# EAGLE design EYEO_Flower3_Sch (EAGLE 9.6.2)
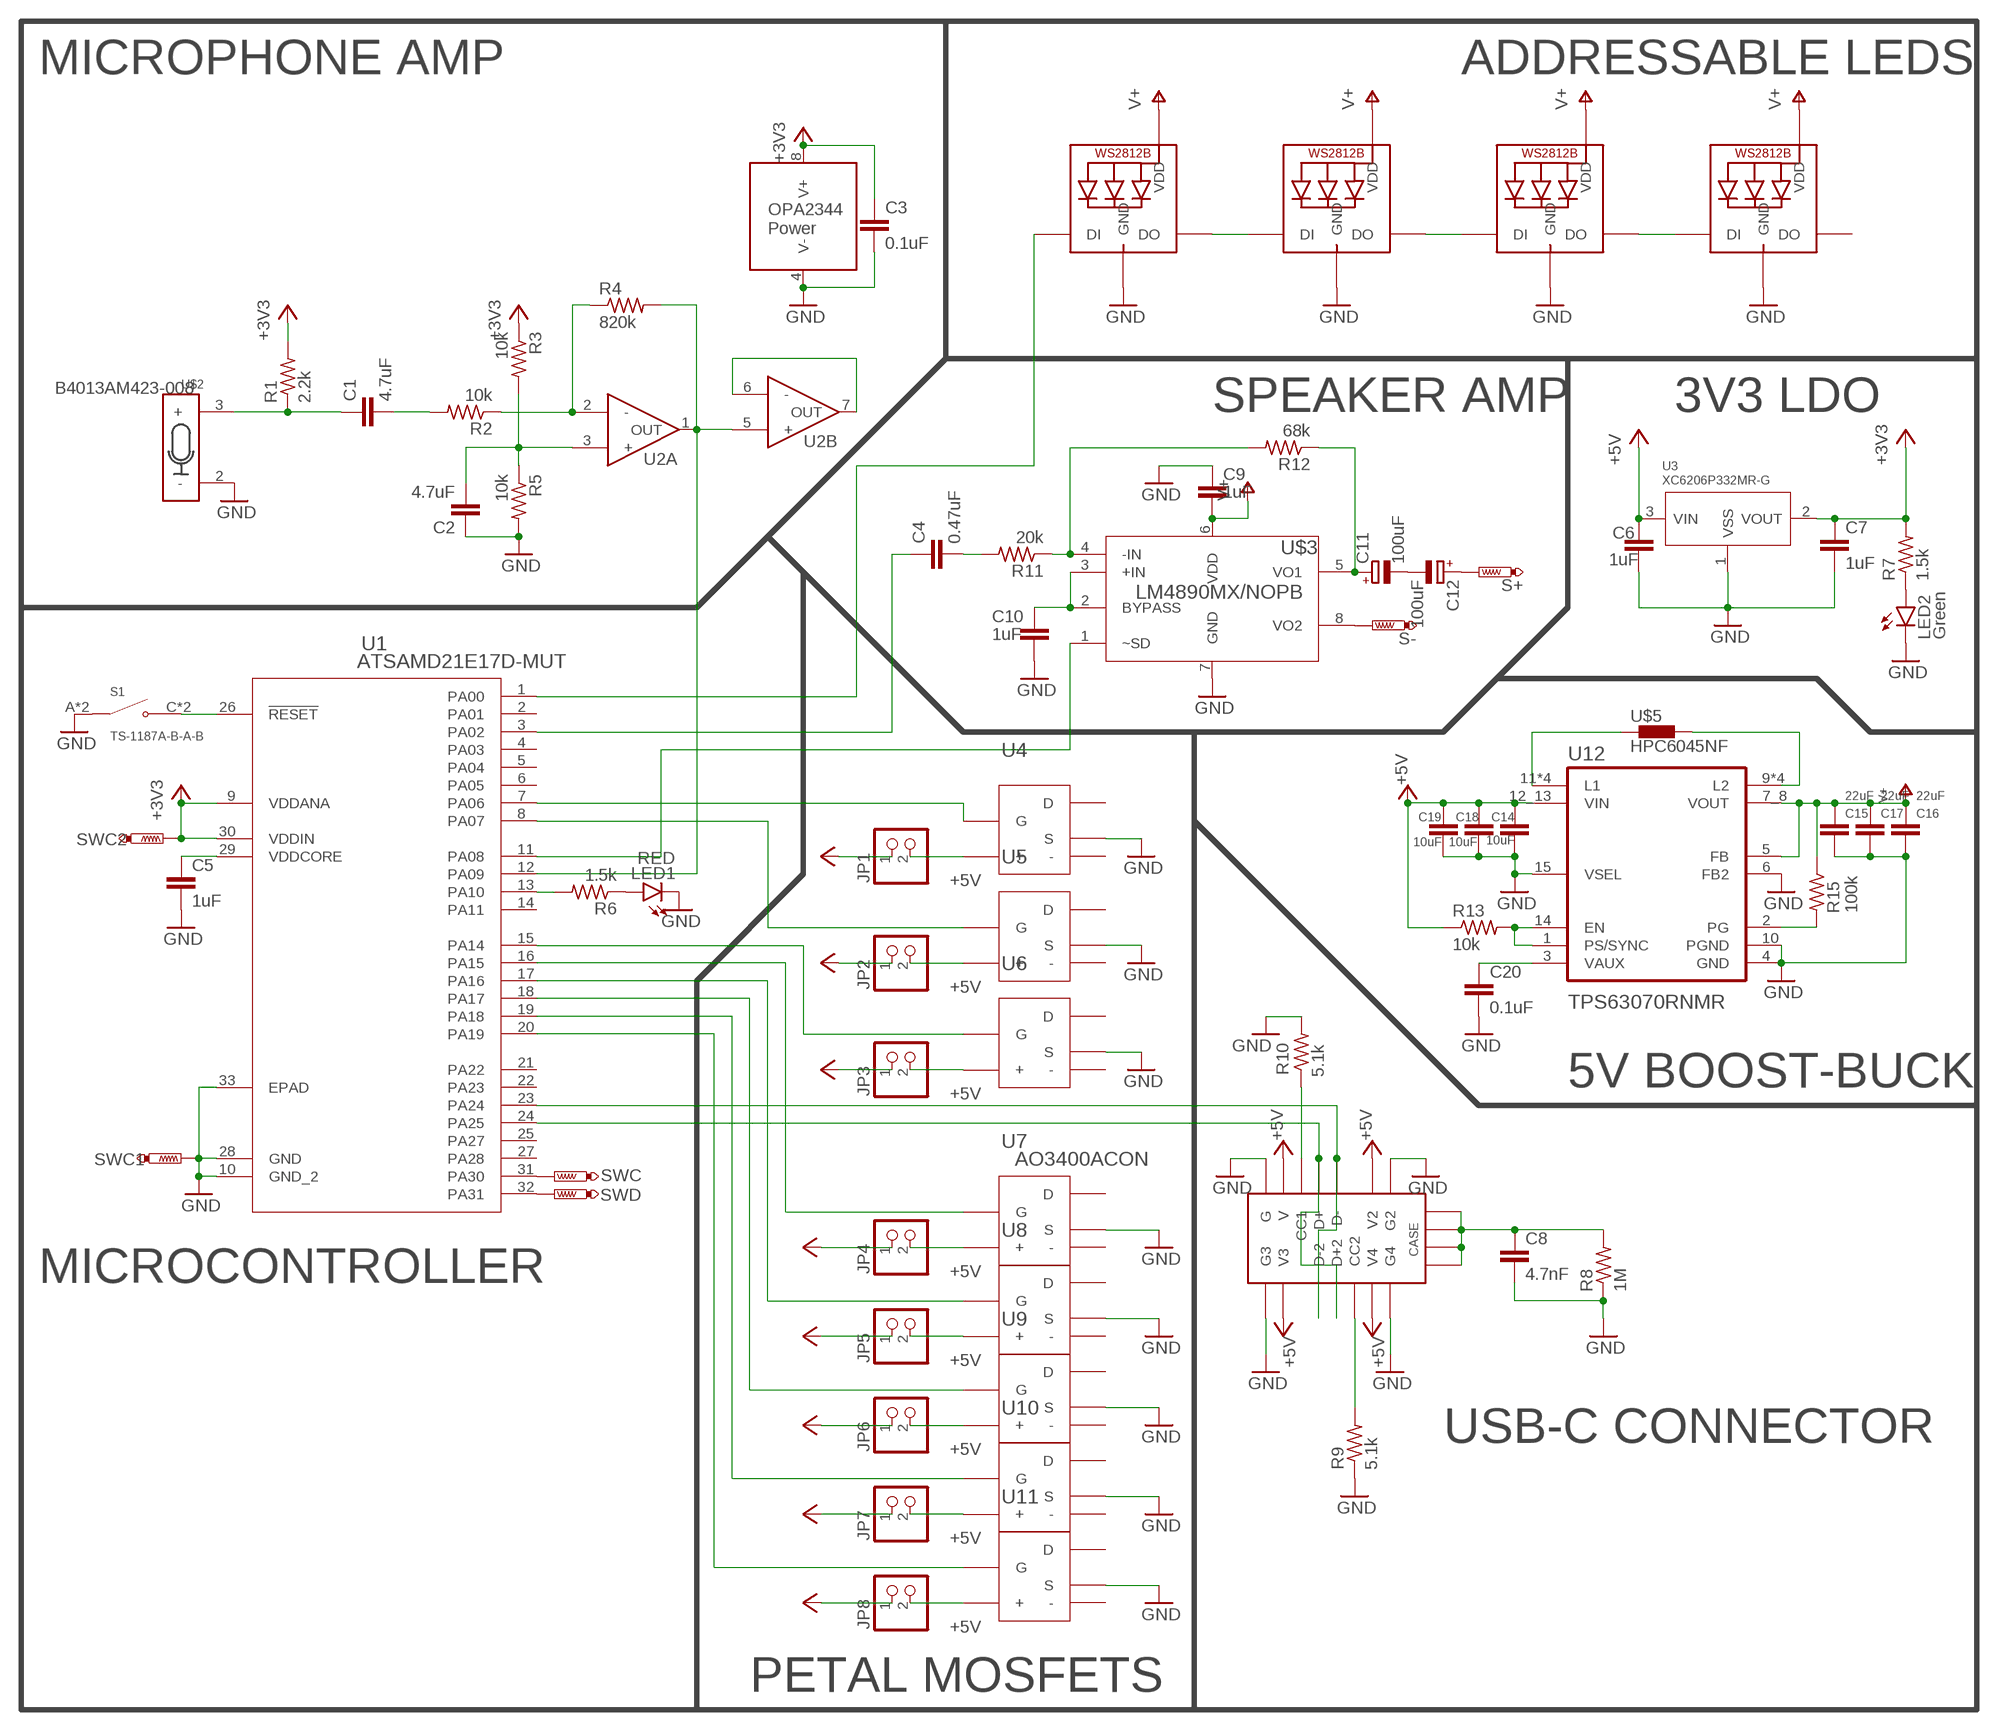
[diagram p0: schematic, sheet 1]

## Parts
C1  4.7uF  C-EUC0603  [C0603]
C2  4.7uF  C-EUC0603  [C0603]
C3  0.1uF  C-EUC0402  [C0402]
C4  0.47uF  C-EUC0603  [C0603]
C5  1uF  C-EUC0603  [C0603]
C6  1uF  C-EUC0603  [C0603]
C7  1uF  C-EUC0603  [C0603]
C8  4.7nF  C-EUC0402  [C0402]
C9  1uF  C-EUC0603  [C0603]
C10  1uF  C-EUC0603  [C0603]
C11  100uF  CPOL-EU153CLV-0505  [153CLV-0505]
C12  100uF  CPOL-EU153CLV-0505  [153CLV-0505]
C14  10uF  C-EUC0603  [C0603]
C15  22uF  C-EUC0603  [C0603]
C16  22uF  C-EUC0603  [C0603]
C17  22uF  C-EUC0603  [C0603]
C18  10uF  C-EUC0603  [C0603]
C19  10uF  C-EUC0603  [C0603]
C20  0.1uF  C-EUC0402  [C0402]
JP1  PINHD-1X2  [1X02]
JP2  PINHD-1X2  [1X02]
JP3  PINHD-1X2  [1X02]
JP4  PINHD-1X2  [1X02]
JP5  PINHD-1X2  [1X02]
JP6  PINHD-1X2  [1X02]
JP7  PINHD-1X2  [1X02]
JP8  PINHD-1X2  [1X02]
LED1  RED  LEDCHIPLED_0805  [CHIPLED_0805]
LED2  Green  LEDCHIPLED_0603  [CHIPLED_0603]
LED3  WS2812B5050  [WS2812B]
LED4  WS2812B5050  [WS2812B]
LED5  WS2812B5050  [WS2812B]
LED6  WS2812B5050  [WS2812B]
R1  2.2k  R-US_R0402  [R0402]
R2  10k  R-US_R0402  [R0402]
R3  10k  R-US_R0402  [R0402]
R4  820k  R-US_R0402  [R0402]
R5  10k  R-US_R0402  [R0402]
R6  1.5k  R-US_R0402  [R0402]
R7  1.5k  R-US_R0402  [R0402]
R8  1M  R-US_R0402  [R0402]
R9  5.1k  R-US_R0402  [R0402]
R10  5.1k  R-US_R0402  [R0402]
R11  20k  R-US_R0402  [R0402]
R12  68k  R-US_R0402  [R0402]
R13  10k  R-US_R0402  [R0402]
R15  100k  R-US_R0402  [R0402]
S1  TS-1187A-B-A-B  [SW_TS-1187A-B-A-B]
S+  PTR11MM  [1MM]
S-  PTR11MM  [1MM]
SWC  PTR1PAD1-13  [P1-13]
SWC1  PTR1PAD1-13  [P1-13]
SWC2  PTR1PAD1-13  [P1-13]
SWD  PTR1PAD1-13  [P1-13]
U1  ATSAMD21E17D-MUT  [QFN32_5X5MC_MCH]
U2  OPA2344UA  [D8]
U3  XC6206P332MR-G  PMIC-LDO-XC6206P332MR-G(SOT23)  [SOT-23]
U4  AO3400ACON  [SOT23-BCE-CON]
U5  AO3400ACON  [SOT23-BCE-CON]
U6  AO3400ACON  [SOT23-BCE-CON]
U7  AO3400ACON  [SOT23-BCE-CON]
U8  AO3400ACON  [SOT23-BCE-CON]
U9  AO3400ACON  [SOT23-BCE-CON]
U10  AO3400ACON  [SOT23-BCE-CON]
U11  AO3400ACON  [SOT23-BCE-CON]
U12  TPS63070RNMR  [VREG_TPS63070RNMR]
U$1  USB-C  [918-418K2022Y40000]
U$2  B4013AM423  [B4013AM423]
U$3  LM4890MX/NOPB  [M08A]
U$5  HPC6045NF  [HPC6045NF]

## Nets
+3V3: C3.1 C7.1 R1.2 R3.1 R7.2 SWC2.TP U1.9(VDDANA) U1.30(VDDIN) U2.8(C:V+) U3.2(VOUT)
+5V: C6.1 C14.1 C18.1 C19.1 JP1.1 JP2.1 JP3.1 JP4.1 JP5.1 JP6.1 JP7.1 JP8.1 R13.1 U3.3(VIN) U12.12_13(VIN) U$1.V U$1.V2 U$1.V3 U$1.V4
GND: C2.1 C3.2 C5.2 C6.2 C7.2 C8.2 C9.1 C10.2 C14.2 C15.2 C16.2 C17.2 C18.2 C19.2 C20.2 LED1.C LED2.C LED3.3-GND(GND) LED4.3-GND(GND) LED5.3-GND(GND) LED6.3-GND(GND) R5.2 R8.1 R9.1 R10.2 S1.A(COM) S1.B(COM) SWC1.TP U1.10(GND_2) U1.28(GND) U1.33(EPAD) U2.4(C:V-) U3.1(VSS) U4.S U5.S U6.S U7.S U8.S U9.S U10.S U11.S U12.4(GND) U12.6(FB2) U12.10(PGND) U12.15(VSEL) U$1.G U$1.G2 U$1.G3 U$1.G4 U$2.2(-) U$3.7(GND)
N$1: LED1.A R6.1
N$2: S1.C(NO) S1.D(NO) U1.26(!RESET)
N$3: LED2.A R7.1
N$4: C5.1 U1.29(VDDCORE)
N$5: C8.1 R8.2 U$1.OG1 U$1.OG2 U$1.OG3 U$1.OG4
N$6: R6.2 U1.13(PA10)
N$7: U1.23(PA24) U$1.D- U$1.D-2
N$8: U1.24(PA25) U$1.D+ U$1.D+2
N$9: SWC.TP U1.31(PA30)
N$10: SWD.TP U1.32(PA31)
N$11: R4.2 U1.12(PA09) U2.1(A:OUT) U2.5(B:+)
N$12: R2.1 R4.1 U2.2(A:-)
N$13: R10.1 U$1.CC1
N$14: R9.2 U$1.CC2
N$15: C2.2 R3.2 R5.1 U2.3(A:+)
N$16: C1.2 R2.2
N$17: C1.1 R1.1 U$2.3(+)
N$18: U2.6(B:-) U2.7(B:OUT)
N$19: C4.1 U1.3(PA02)
N$20: C4.2 R11.2
N$21: R11.1 R12.2 U$3.4(-IN)
N$22: C11.- C12.-
N$23: C10.1 U$3.2(BYPASS) U$3.3(+IN)
N$24: C11.+ R12.1 U$3.5(VO1)
N$25: U1.11(PA08) U$3.1(~SD)
N$26: S-.TP U$3.8(VO2)
N$27: U1.7(PA06) U4.G
N$28: U1.8(PA07) U5.G
N$29: U1.15(PA14) U6.G
N$30: U1.16(PA15) U7.G
N$31: U1.17(PA16) U8.G
N$32: U1.18(PA17) U9.G
N$33: U1.19(PA18) U10.G
N$34: U1.20(PA19) U11.G
N$35: LED3.4-DIN(DI) U1.1(PA00)
N$36: LED3.2-DOUT(DO) LED4.4-DIN(DI)
N$37: LED4.2-DOUT(DO) LED5.4-DIN(DI)
N$38: LED5.2-DOUT(DO) LED6.4-DIN(DI)
N$39: C12.+ S+.TP
N$40: JP1.2 U4.+
N$41: JP2.2 U5.+
N$42: JP3.2 U6.+
N$43: JP4.2 U7.+
N$44: JP5.2 U8.+
N$45: JP6.2 U9.+
N$46: JP7.2 U10.+
N$47: JP8.2 U11.+
N$49: R13.2 U12.1(PS/SYNC) U12.14(EN)
N$50: U12.11(L1) U12.11_1(L1) U12.11_2(L1) U12.11_3(L1) U$5.P$1
N$51: C20.1 U12.3(VAUX)
N$52: U12.9(L2) U12.9_1(L2) U12.9_2(L2) U12.9_3(L2) U$5.P$2
N$54: R15.2 U12.2(PG)
V+: C9.2 C15.1 C16.1 C17.1 LED3.1-VDD(VDD) LED4.1-VDD(VDD) LED5.1-VDD(VDD) LED6.1-VDD(VDD) R15.1 U12.5(FB) U12.7_8(VOUT) U$3.6(VDD)
Unconnected: LED6.2-DOUT(DO) U1.2(PA01) U1.4(PA03) U1.5(PA04) U1.6(PA05) U1.14(PA11) U1.21(PA22) U1.22(PA23) U1.25(PA27) U1.27(PA28) U4.- U4.D U5.- U5.D U6.- U6.D U7.- U7.D U8.- U8.D U9.- U9.D U10.- U10.D U11.- U11.D

## Notes on the sheet
- MICROPHONE AMP | ADDRESSABLE LEDS
- SPEAKER AMP | 3V3 LDO
- 5V BOOST-BUCK
- MICROCONTROLLER
- USB-C CONNECTOR
- PETAL MOSFETS

## Library data of the parts
C1 C2 = rcl_MOD:C-EU: CAPACITOR, European symbol; LCSC_PART: C19666; SPICEPREFIX: C
C3 C20 = rcl_MOD:C-EU: CAPACITOR, European symbol; LCSC_PART: C307331; SPICEPREFIX: C
C4 = rcl_MOD:C-EU: CAPACITOR, European symbol; LCSC_PART: C1623; SPICEPREFIX: C
C5-C7 C9 C10 = rcl_MOD:C-EU: CAPACITOR, European symbol; LCSC_PART: C15849; SPICEPREFIX: C
C8 = rcl_MOD:C-EU: CAPACITOR, European symbol; LCSC_PART: C1538; SPICEPREFIX: C
C11 C12 = rcl_MOD:CPOL-EU: POLARIZED CAPACITOR, European symbol; LCSC_PART: C3347; SPICEPREFIX: C
C14 C18 C19 = rcl_MOD:C-EU: CAPACITOR, European symbol; LCSC_PART: C96446; SPICEPREFIX: C
C15-C17 = rcl_MOD:C-EU: CAPACITOR, European symbol; LCSC_PART: C59461; SPICEPREFIX: C
JP1-JP8 = pinhead:PINHD-1X2: PIN HEADER; LCSC_PART: C2889984
LED1 = led:LED: LED OSRAM: - CHIPLED LG R971, LG N971, LY N971, LG Q971, LY Q971, LO R971, LY R971 LH N974, LH R974 LS Q976, LO Q976, LY Q976 LO Q996 - Hyper CHIPLED LW Q18S LB Q993, LB Q99A, LB R99A - SideLED LS A670, LO A670, LY A670, LG A670, LP A670 LB A673, LV A673, LT A673, LW A673 LH A674 LY A675 LS A676, LA A676, LO A676, LY A676, LW A676 LS A679, LY A679, LG A679 - Hyper Micro SIDELED® LS Y876, LA Y876, LO Y876, LY Y876 LT Y87S - SmartLED LW L88C, LW L88S LB L89C, LB L89S, LG L890 LS L89K, LO L89K, LY L89K LS L896, LA L896, LO L896, LY L896 - TOPLED LS T670, LO T670, LY T670, LG T670, LP T670 LSG T670, LSP T670, LSY T670, LOP T670, LYG T670 LG T671, LOG T671, LSG T671 LB T673, LV T673, LT T673, LW T673 LH T674 LS T676, LA T676, LO T676, LY T676, LB T676, LH T676, LSB T676, LW T676 LB T67C, LV T67C, LT T67C, LS T67K, LO T67K, LY T67K, LW E67C LS E67B, LA E67B, LO E67B, LY E67B, LB E67C, LV E67C, LT E67C LW T67C LS T679, LY T679, LG T679 LS T770, LO T770, LY T770, LG T770, LP T770 LB T773, LV T773, LT T773, LW T773 LH T774 LS E675, LA E675, LY E675, LS T675 LS T776, LA T776, LO T776, LY T776, LB T776 LHGB T686 LT T68C, LB T68C - Hyper Mini TOPLED® LB M676 - Mini TOPLED Santana® LG M470 LS M47K, LO M47K, LY M47K Source: http://www.osram.convergy.de LUXEON: - LUMILED® LXK2-PW12-R00, LXK2-PW12-S00, LXK2-PW14-U00, LXK2-PW14-V00 LXK2-PM12-R00, LXK2-PM12-S00, LXK2-PM14-U00 LXK2-PE12-Q00, LXK2-PE12-R00, LXK2-PE12-S00, LXK2-PE14-T00, LXK2-PE14-U00 LXK2-PB12-K00, LXK2-PB12-L00, LXK2-PB12-M00, LXK2-PB14-N00, LXK2-PB14-P00, LXK2-PB14-Q00 LXK2-PR12-L00, LXK2-PR12-M00, LXK2-PR14-Q00, LXK2-PR14-R00 LXK2-PD12-Q00, LXK2-PD12-R00, LXK2-PD12-S00 LXK2-PH12-R00, LXK2-PH12-S00 LXK2-PL12-P00, LXK2-PL12-Q00, LXK2-PL12-R00 Source: www.luxeon.com KINGBRIGHT: KA-3528ASYC Source: www.kingbright.com; LCSC_PART: C84256
LED2 = led:LED: LED OSRAM: - CHIPLED LG R971, LG N971, LY N971, LG Q971, LY Q971, LO R971, LY R971 LH N974, LH R974 LS Q976, LO Q976, LY Q976 LO Q996 - Hyper CHIPLED LW Q18S LB Q993, LB Q99A, LB R99A - SideLED LS A670, LO A670, LY A670, LG A670, LP A670 LB A673, LV A673, LT A673, LW A673 LH A674 LY A675 LS A676, LA A676, LO A676, LY A676, LW A676 LS A679, LY A679, LG A679 - Hyper Micro SIDELED® LS Y876, LA Y876, LO Y876, LY Y876 LT Y87S - SmartLED LW L88C, LW L88S LB L89C, LB L89S, LG L890 LS L89K, LO L89K, LY L89K LS L896, LA L896, LO L896, LY L896 - TOPLED LS T670, LO T670, LY T670, LG T670, LP T670 LSG T670, LSP T670, LSY T670, LOP T670, LYG T670 LG T671, LOG T671, LSG T671 LB T673, LV T673, LT T673, LW T673 LH T674 LS T676, LA T676, LO T676, LY T676, LB T676, LH T676, LSB T676, LW T676 LB T67C, LV T67C, LT T67C, LS T67K, LO T67K, LY T67K, LW E67C LS E67B, LA E67B, LO E67B, LY E67B, LB E67C, LV E67C, LT E67C LW T67C LS T679, LY T679, LG T679 LS T770, LO T770, LY T770, LG T770, LP T770 LB T773, LV T773, LT T773, LW T773 LH T774 LS E675, LA E675, LY E675, LS T675 LS T776, LA T776, LO T776, LY T776, LB T776 LHGB T686 LT T68C, LB T68C - Hyper Mini TOPLED® LB M676 - Mini TOPLED Santana® LG M470 LS M47K, LO M47K, LY M47K Source: http://www.osram.convergy.de LUXEON: - LUMILED® LXK2-PW12-R00, LXK2-PW12-S00, LXK2-PW14-U00, LXK2-PW14-V00 LXK2-PM12-R00, LXK2-PM12-S00, LXK2-PM14-U00 LXK2-PE12-Q00, LXK2-PE12-R00, LXK2-PE12-S00, LXK2-PE14-T00, LXK2-PE14-U00 LXK2-PB12-K00, LXK2-PB12-L00, LXK2-PB12-M00, LXK2-PB14-N00, LXK2-PB14-P00, LXK2-PB14-Q00 LXK2-PR12-L00, LXK2-PR12-M00, LXK2-PR14-Q00, LXK2-PR14-R00 LXK2-PD12-Q00, LXK2-PD12-R00, LXK2-PD12-S00 LXK2-PH12-R00, LXK2-PH12-S00 LXK2-PL12-P00, LXK2-PL12-Q00, LXK2-PL12-R00 Source: www.luxeon.com KINGBRIGHT: KA-3528ASYC Source: www.kingbright.com; LCSC_PART: C72043
LED3-LED6 = WS2812B:WS2812B: Check availability <https://pricing.snapeda.com/parts/WS2812B/Worldsemi/view-part?ref=eda>; AVAILABILITY: Not in stock; DESCRIPTION: Intelligent Control Led Integrated Light Source Pack Of 10; LCSC_PART: C2761795; MF: Worldsemi; MP: WS2812B; PACKAGE: None; PRICE: None
R1 = rcl_MOD:R-US_: RESISTOR, American symbol; LCSC_PART: C25879; SPICEPREFIX: R
R2 R3 R5 R13 = rcl_MOD:R-US_: RESISTOR, American symbol; LCSC_PART: C25744; SPICEPREFIX: R
R4 = rcl_MOD:R-US_: RESISTOR, American symbol; LCSC_PART: C67558; SPICEPREFIX: R
R6 R7 = rcl_MOD:R-US_: RESISTOR, American symbol; LCSC_PART: C25867; SPICEPREFIX: R
R8 = rcl_MOD:R-US_: RESISTOR, American symbol; LCSC_PART: C26083; SPICEPREFIX: R
R9 R10 = rcl_MOD:R-US_: RESISTOR, American symbol; LCSC_PART: C25905; SPICEPREFIX: R
R11 = rcl_MOD:R-US_: RESISTOR, American symbol; LCSC_PART: C25765; SPICEPREFIX: R
R12 = rcl_MOD:R-US_: RESISTOR, American symbol; LCSC_PART: C36871; SPICEPREFIX: R
R15 = rcl_MOD:R-US_: RESISTOR, American symbol; LCSC_PART: C25741; SPICEPREFIX: R
S1 = TS-1187A-B-A-B:TS-1187A-B-A-B: SPST 50mA @ 12VDC Top Actuated Round Button 160gf SMD Tactile Switches RoHS Check availability <https://pricing.snapeda.com/parts/TS-1187A-B-A-B/XKB%20Industrial%20Precision/view-part?ref=eda>; AVAILABILITY: Not in stock; DESCRIPTION: TS-1187A-B-A-B XKB Connectivity; LCSC_PART: C318884; MF: XKB Industrial Precision; MP: TS-1187A-B-A-B; PACKAGE: Package; PRICE: None
S+ S- = testpad:PTR1: TEST PIN; LCSC_PART: C238122
SWC SWC1 SWC2 SWD = testpad:PTR1: TEST PIN
U1 = ATSAMDE17D:ATSAMD21E17D-MUT; COPYRIGHT: Copyright (C) 2022 Ultra Librarian. All rights reserved.; DIGI-KEY_PART_NUMBER_1: ATSAMD21E17D-MUTCT-ND; DIGI-KEY_PART_NUMBER_2: ATSAMD21E17D-MUTDKR-ND; DIGI-KEY_PART_NUMBER_3: ATSAMD21E17D-MUTTR-ND; MANUFACTURER_PART_NUMBER: ATSAMD21E17D-MUT; MFR_NAME: Microchip
U2 = OPA2344:OPA2344UA; COPYRIGHT: Copyright (C) 2022 Ultra Librarian. All rights reserved.; DIGI-KEY_PART_NUMBER_1: OPA2344UA-ND; DIGI-KEY_PART_NUMBER_2: 2156-OPA2344UA-ND; DIGI-KEY_PART_NUMBER_3: 2156-OPA2344UA-TI-ND; LCSC_PART: C202213; MANUFACTURER_PART_NUMBER: OPA2344UA; MFR_NAME: Texas Instruments
U3 = PMIC-LDO-XC6206P332MR-G_SOT23_:PMIC-LDO-XC6206P332MR-G(SOT23): 310030099 Check availability <https://pricing.snapeda.com/parts/XC6206P332MR-G/Torex/view-part?ref=eda>; AVAILABILITY: In Stock; DESCRIPTION: Linear Voltage Regulator IC Positive Fixed 1 Output 200mA SOT-23; LCSC_PART: C5446; MF: Torex; MP: XC6206P332MR-G; PACKAGE: SOT-23-3 Torex; PRICE: None; PURCHASE-URL: https://pricing.snapeda.com/search/part/XC6206P332MR-G/?ref=eda
U4-U11 = AO3400A+con:AO3400A; LCSC_PART: C20917
U12 = TPS63070RNMR:TPS63070RNMR: Check availability <https://pricing.snapeda.com/parts/TPS63070RNMR/Texas%20Instruments/view-part?ref=eda>; AVAILABILITY: In Stock; DESCRIPTION: Wide input voltage (2V-16V) buck-boost converter; LCSC_PART: C2876599; MF: Texas Instruments; MP: TPS63070RNMR; PACKAGE: VQFN-HR-15 Texas Instruments; PRICE: None; PURCHASE-URL: https://pricing.snapeda.com/search/part/TPS63070RNMR/?ref=eda
U$1 = USB:USB-C; LCSC_PART: C168704
U$2 = Microphone:B4013AM423; LCSC_PART: C233794; NUM: B4013AM423-008
U$3 = LM4890:LM4890MX/NOPB; COPYRIGHT: Copyright (C) 2022 Ultra Librarian. All rights reserved.; DIGI-KEY_PART_NUMBER_1: 2156-LM4890MX/NOPB-ND; DIGI-KEY_PART_NUMBER_2: 296-47333-1-ND; DIGI-KEY_PART_NUMBER_3: 296-47333-2-ND; DIGI-KEY_PART_NUMBER_4: 296-47333-6-ND; DIGI-KEY_PART_NUMBER_5: LM4890MX/NOPBTR-ND; LCSC_PART: C117476; MANUFACTURER_PART_NUMBER: LM4890MX/NOPB; MFR_NAME: Texas Instruments
U$5 = inductors-mod:HPC6045NF; LCSC_PART: C357076

## Board
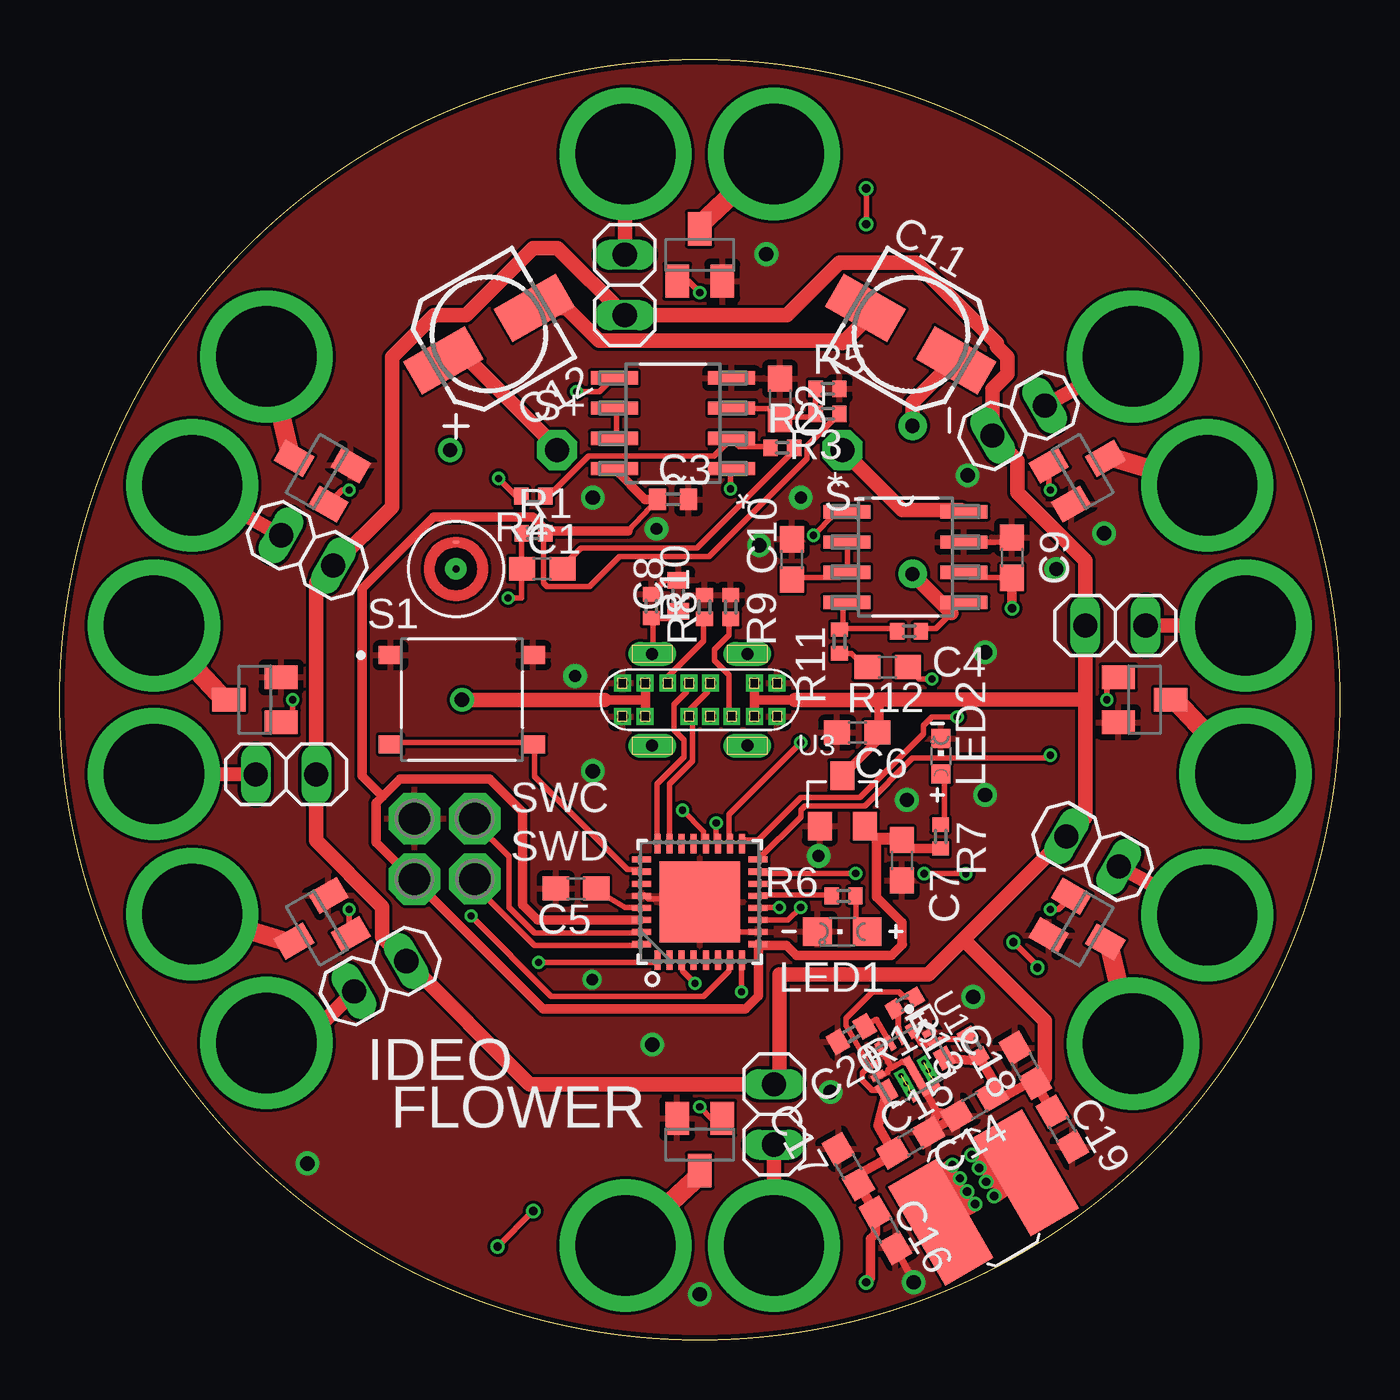
[diagram p1: board, top side]
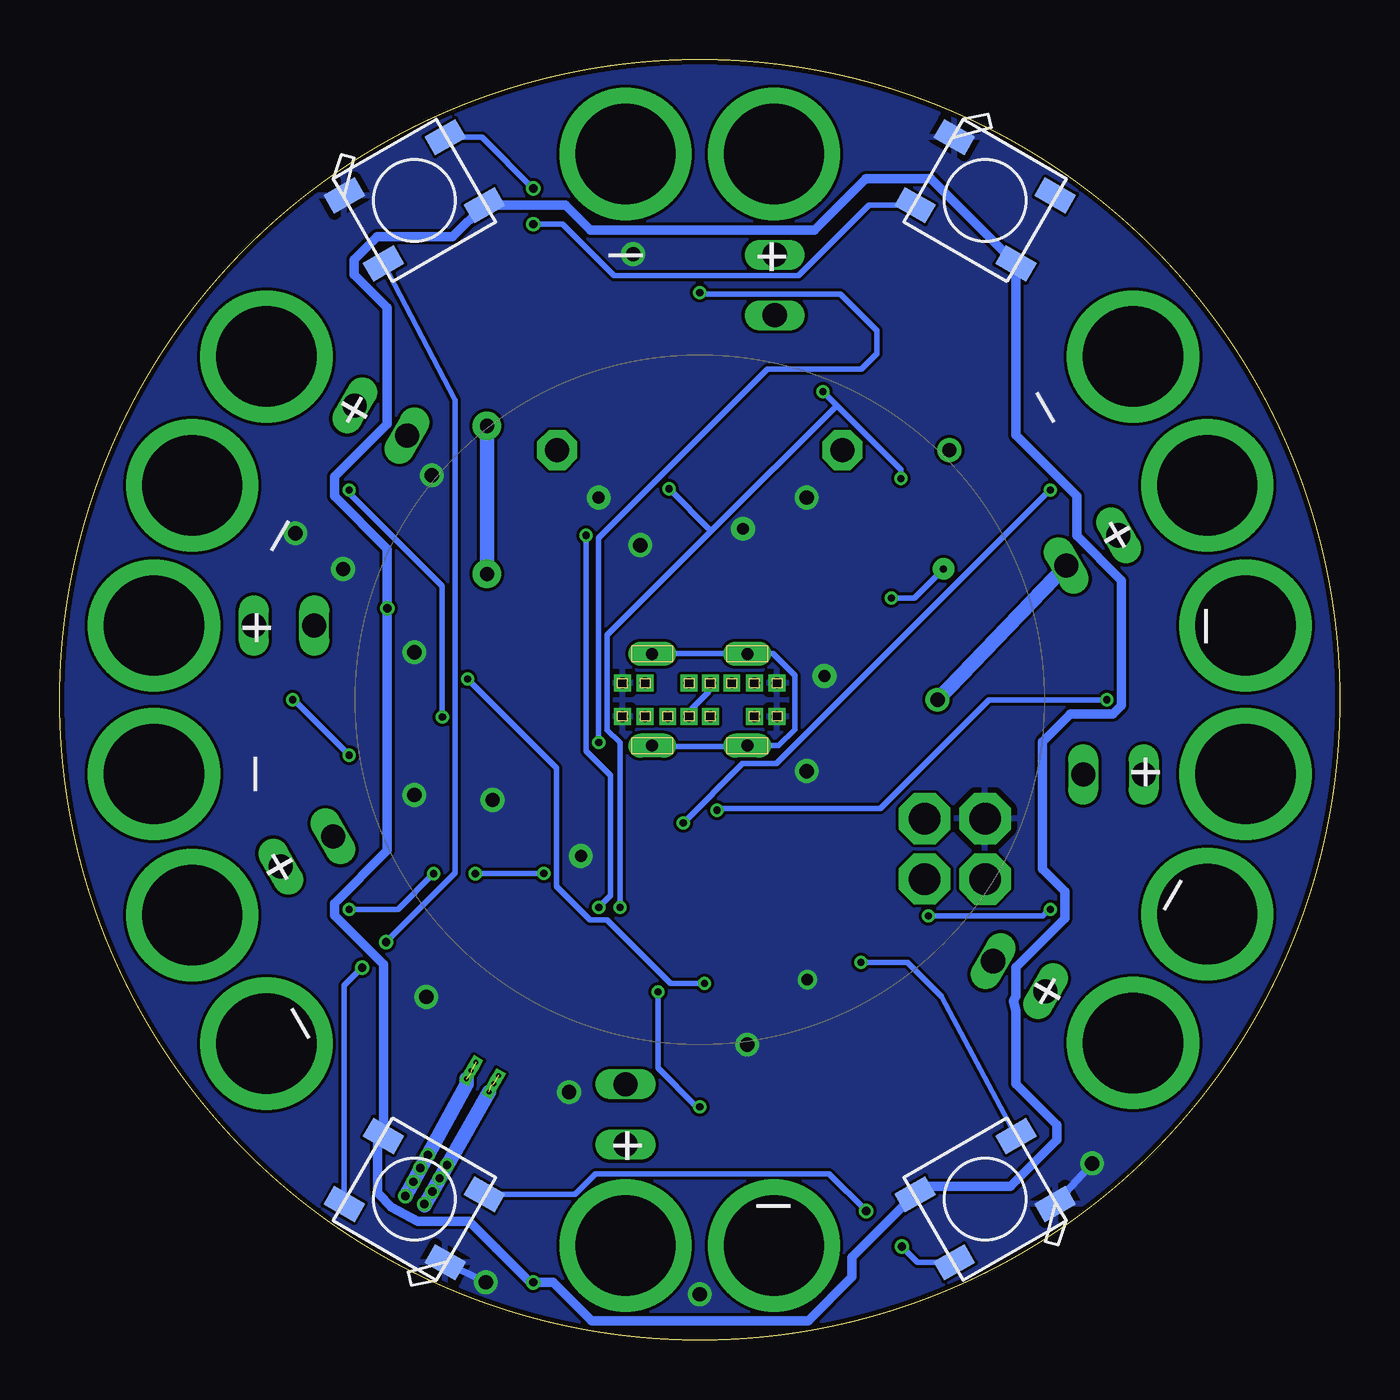
[diagram p2: board, bottom side, seen from below]

Size 53.85 x 53.85 mm. Coordinates in mm from the lower left corner, seen from the top.
Outline: circle at 26.93,26.93 radius 26.93
Copper layers (1*16): Top 0.035mm / dielectric 1.6mm / Bottom 0.035mm
Design rules "jlcpcb-2layers *": minimum track width 9mil, minimum drill 0.2mm, track to track 5mil, track to pad 5mil, pad to pad 5mil, via to via 5mil, smd to smd 5mil, copper to edge 0.2mm, drill to drill 6mil, minimum pad ring 5mil, minimum via ring 5mil, stop-mask expansion 4mil, vias tented up to drill 0mil, thermal gap 10mil

### Footprints (pad centres in the part's own frame; a part is rotated, then mirrored left to right if it is on the bottom)
C0603 = smd 1.1 x 1: 1 -0.85,0; 2 0.85,0
C0402 = smd 0.7 x 0.9: 1 -0.65,0; 2 0.65,0
153CLV-0505 = smd 3 x 1.6: + 2.2,0; - -2.2,0
1X02 = drill 1.016 long: 1 -1.27,0; 2 1.27,0
CHIPLED_0805 = smd 1.2 x 1.2: A 0,-1.05; C 0,1.05
CHIPLED_0603 = smd 0.8 x 0.8: A 0,-0.75; C 0,0.75
WS2812B = smd 1.5 x 0.9: 1-VDD 2.45,-1.65; 2-DOUT 2.45,1.65; 3-GND -2.45,1.65; 4-DIN -2.45,-1.65
R0402 = smd 0.6 x 0.7: 1 -0.5,0; 2 0.5,0
SW_TS-1187A-B-A-B = smd 1 x 0.75: A -3,1.875; B 3,1.875; C -3,-1.875; D 3,-1.875
1MM = drill 1 pad 1.676 octagon: TP 0,0
P1-13 = drill 1.321 pad 2.159 octagon: TP 0,0
QFN32_5X5MC_MCH = smd 0.813 x 0.254: 1 -2.451,1.778; 2 -2.451,1.27; 3 -2.451,0.762; 4 -2.451,0.254; 5 -2.451,-0.254; 6 -2.451,-0.762; 7 -2.451,-1.27; 8 -2.451,-1.778; 17 2.451,-1.778; 18 2.451,-1.27; 19 2.451,-0.762; 20 2.451,-0.254; 21 2.451,0.254; 22 2.451,0.762; 23 2.451,1.27; 24 2.451,1.778 | smd 0.254 x 0.813: 9 -1.778,-2.451; 10 -1.27,-2.451; 11 -0.762,-2.451; 12 -0.254,-2.451; 13 0.254,-2.451; 14 0.762,-2.451; 15 1.27,-2.451; 16 1.778,-2.451; 25 1.778,2.451; 26 1.27,2.451; 27 0.762,2.451; 28 0.254,2.451; 29 -0.254,2.451; 30 -0.762,2.451; 31 -1.27,2.451; 32 -1.778,2.451 | smd 3.404 x 3.404: 33 0,0
D8 = smd 1.981 x 0.559: 1 -2.464,1.905; 2 -2.464,0.635; 3 -2.464,-0.635; 4 -2.464,-1.905; 5 2.464,-1.905; 6 2.464,-0.635; 7 2.464,0.635; 8 2.464,1.905
SOT-23 = smd 1.016 x 1.2: 1 -0.95,-1.06; 2 0.95,-1.06; 3 0,1.06
SOT23-BCE-CON = drill 4.22 pad 5.56: + -3.123,4.254; - 3.123,4.254 | smd 1 x 1.4: D 0,1.1; G -0.95,-1.1; S 0.95,-1.1
VREG_TPS63070RNMR = smd 0.6 x 0.25: 1 -1.15,0.75; 2 -1.15,0.25; 3 -1.15,-0.25; 4 -1.15,-0.75 | smd 0.25 x 0.6: 5 -0.725,-1.4; 6 -0.225,-1.4; 14 -0.225,1.4; 15 -0.725,1.4 | smd 0.85 x 0.7: 7_8 0.525,-1.4; 12_13 0.525,1.4 | smd 1.45 x 0.35: 9 0.775,-0.5; 11 0.775,0.5 | drill 0.2 pad 0.4 square: 9_1 0.25,-0.55; 9_2 0.65,-0.55; 9_3 1.05,-0.55; 11_1 0.25,0.55; 11_2 0.65,0.55; 11_3 1.05,0.55 | smd 1.8 x 0.35: 10 0.6,0
918-418K2022Y40000 = drill 0.45 pad 0.7 square: CC1 -1.35,0.7; CC2 1.35,-0.7; D+ -0.45,0.7; D+2 0.45,-0.7; D- 0.45,0.7; D-2 -0.45,-0.7; G -3.25,0.7; G2 3.25,0.7; G3 -3.25,-0.7; G4 3.25,-0.7; V -2.3,0.7; V2 2.3,0.7; V3 -2.3,-0.7; V4 2.3,-0.7 | drill 0.5 pad 1 long: OG1 -2,1.93; OG2 2,1.93; OG3 -2,-1.93; OG4 2,-1.93
B4013AM423 = smd 0.305 x 0.152: 2 0,1.125 | drill 0.3 pad 0.9: 3 0,0
M08A = smd 1.981 x 0.559: 1 -2.464,1.905; 2 -2.464,0.635; 3 -2.464,-0.635; 4 -2.464,-1.905; 5 2.464,-1.905; 6 2.464,-0.635; 7 2.464,0.635; 8 2.464,1.905
HPC6045NF = smd 2.35 x 4.8: P$1 -2.075,0; P$2 2.075,0

### Placement (x,y rotation side)
C1  20.3,32.43 0 top
C2  30.3,39.58 270 top
C3  25.8,35.35 0 top
C4  34.83,28.3 180 top
C5  21.73,18.99 180 top
C6  33.55,25.55 180 top
C7  35.43,20.18 270 top
C8  26.03,31.3 90 top
C9  40.05,32.9 270 top
C10  30.8,32.83 90 top
C11  35.8,42.3 330 top
C12  18.05,42.3 210 top
C14  38.49,9.86 210 top
C15  35.8,8.3 30 top
C16  34.74,4.61 300 top
C17  33.18,7.3 120 top
C18  40.61,11.55 120 top
C19  42.18,8.86 300 top
C20  33.3,12.86 210 top
JP1  13.49,15.3 210 top
JP2  30.05,9.49 270 top
JP3  43.45,20.55 330 top
JP4  44.41,30.05 0 top
JP5  40.34,38.67 30 top
JP6  23.78,44.37 90 top
JP7  10.42,33.21 150 top
JP8  9.53,23.79 180 top
LED1  32.93,17.18 90 top
LED2  37.08,24.55 0 top
LED3  14.93,5.93 210 bottom
LED4  38.93,5.93 150 bottom
LED5  38.93,47.93 30 bottom
LED6  14.93,47.93 330 bottom
R1  19.93,33.93 0 top
R2  30.4,37.53 0 top
R3  32.3,38.95 180 top
R4  19.93,35.49 180 top
R5  32.3,40 0 top
R6  32.98,18.68 180 top
R7  37.05,21.18 270 top
R8  24.89,30.86 270 top
R9  28.23,30.83 270 top
R10  27.13,30.83 90 top
R11  32.8,29.38 270 top
R12  35.73,29.8 180 top
R13  38.43,12.36 120 top
R15  35.55,14.18 210 top
S1  16.93,26.93 0 top
S+  20.93,37.43 0 top
S-  32.93,37.43 180 top
SWC  17.46,21.92 0 top
SWC1  14.93,21.93 0 top
SWC2  14.93,19.39 0 top
SWD  17.47,19.39 0 top
U1  26.93,18.43 90 top
U2  25.8,38.55 180 top
U3  32.93,22.68 0 top
U4  10.83,17.33 120 top
U5  26.93,8.23 180 top
U6  43.03,17.29 240 top
U7  45.63,26.93 270 top
U8  43.03,36.53 300 top
U9  26.93,45.63 0 top
U10  10.83,36.53 60 top
U11  8.23,26.93 90 top
U12  35.74,11.61 300 top
U$1  26.93,26.93 0 top
U$2  16.68,32.43 0 top
U$3  35.58,32.93 0 top
U$5  38.86,5.99 210 top

### Tracks (layer width: path | path; a pad name or v marks a point on that pad's centre or on a via)
+3V3
  Top 0.229: R3.1 32.85,39 31.44,37.59 31.44,37.08 27.32,32.95 23.56,32.95 22.3,31.69 20.5,31.69 20.36,31.83 20.36,33.86 R1.2 20.51,34.02 | 35.45,20.68 C7.1 35.43,20.83 35.44,20.82 35.44,21.14 | R7.2 | 29.4,16.59 U1.9 | 34.35,21.14 U3.2 | 23.91,34.02 C3.1 | 24.42,17.66 U1.30 | 14.82,19.44 SWC2.TP 14.99,19.26
  Top 0.406: R7.2 35.45,20.68 | 29.4,16.59 30.57,16.59 30.99,16.18 34.98,16.18 35.44,16.64 35.43,16.65 35.43,17.56 34.35,18.64 34.35,21.03 C7.1 | 35.44,21.14 34.35,21.14 | 23.91,34.02 20.51,34.02 19.92,34.61 15.73,34.61 12.73,31.6 12.73,23.73 13.59,22.86 | 24.42,17.66 20.1,17.66 19.47,18.29 19.47,22.21 18.08,23.6 14.33,23.6 13.59,22.86 | 13.59,22.86 13.32,22.59 13.32,20.93 14.82,19.44 | U1.9 29.4,16.62 29.4,14.47 28.85,13.92 20.34,13.92 14.99,19.26 | U2.8 24.63,35.35 C3.1
+5V  (via drill 0.6 pad 1)
  Top 0.229: 24.65,26.25 U$1.V3 | 24.65,27.62 U$1.V
  Top 0.406: U$1.V4 29.23,26.93 | 29.23,26.93 U$1.V2 | 29.23,26.93 30.93,26.93 | 24.65,27.62 24.65,26.93 | 24.65,26.93 24.65,26.25 | 34.45,26.94 34.45,26.93 34.45,25.6 C6.1 34.4,25.21 U3.3 | 24.65,26.93 22.93,26.93 | U12.12_13 38.53,11.75 R13.1 38.74,11.83 39.35,10.79 C14.1 39.6,10.17 40.91,10.91 C18.1 C19.1
  Top 0.61: 30.93,26.93 34.45,26.93 | 34.45,26.94 43.14,26.94 | 43.14,26.94 43.14,27.03 JP4.1 43.14,32.77 40.28,35.63 40.28,36.99 JP5.1 39.24,39.99 39.87,40.62 39.87,41.34 39.43,41.78 39.43,41.93 36.04,45.31 32.8,45.31 30.59,43.1 JP6.1 20.95,45.93 19.93,45.93 17.11,43.11 15.75,43.11 13.98,41.34 13.98,35.04 JP7.1 10.8,31.85 JP8.1 10.8,21 13.57,18.22 13.57,16.95 JP1.1 19.77,10.76 JP2.1 30.28,10.98 30.28,15.38 36.55,15.38 38.01,16.84 | 43.14,26.94 43.14,21.98 JP3.1 38.01,16.84 | C18.1 41.27,11.05 41.44,11.05 41.44,13.41 38.01,16.84 | 22.93,26.93 v16.93,26.93
  Bottom 0.61: v16.93,26.93 JP7.1
GND  (via drill 0.5 pad 0.8, 0.5 pad 1, 0.6 pad 1)
  Top 0.229: 26.91,18.55 24.77,18.55 24.59,18.73 U1.28 | 26.91,18.55 U1.33 | 30.18,40.42 C2.1 | R8.1 25.48,31.95 C8.2 | U$3.7 39.86,33.56 C9.1 | U1.10 28.3,17.16 26.91,18.55
  Top 0.254: U12.6 34.55,11.11 34.83,11.27 34.86,11.37 34.98,11.44 | 34.98,11.44 35.43,11.7 35.64,11.65 35.96,11.09 U12.10 | U12.4 34.98,11.44
  Top 0.305: U12.10 36.92,9.58 | C16.2 v35.93,2.43
  Top 0.406: 36.92,9.58 C15.2 C14.2 36.92,9.58
  Bottom 0.305: LED3.3-GND v10.43,7.43 | LED4.3-GND v35.93,2.43
  other vias: 21.68,27.93 25.11,34.11 31.93,20.36 31.18,35.43 24.93,12.43 22.41,15.16 22.43,23.93 38.93,22.93 38.93,28.93 29.43,33.43 26.93,1.93 38.2,36.37 29.73,45.67 22.43,35.43 35.64,22.72 41.93,32.43 43.93,33.93 38.43,14.43 32.43,10.43
  pour Top: 26.93,53.86 arc-90 53.89,26.89 arc-90 26.99,-0.01 26.93,-0.01 arc-90 -0.01,26.93 arc-90
  pour Bottom: 26.93,53.86 arc-90 53.89,26.89 arc-90 26.99,-0.01 26.93,-0.01 arc-90 -0.01,26.93 arc-90
N$1
  Top 0.229: R6.1 33.48,18.55 33.48,17.66 33.84,17.3 LED1.A
N$2
  Top 0.229: U1.26 24.42,19.79 23.88,19.79 19.97,23.71 19.97,24.95 S1.D 19.79,25.13 13.93,25.13 S1.C
N$3
  Top 0.229: R7.1 37.22,21.69 37.22,23.71 LED2.A
N$4
  Top 0.229: U1.29 24.42,18.19 23.77,18.19 22.74,18.83 C5.1
N$5
  Top 0.229: C8.1 25.73,30.35 24.95,30.35 24.95,30.33 | 24.95,30.33 24.95,28.86 U$1.OG1 | 24.95,30.33 R8.2
  Bottom 0.229: U$1.OG4 28.86,24.95 24.95,24.95 U$1.OG3 23.61,25 22.93,25.68 22.93,27.94 23.85,28.86 24.95,28.86 | 24.95,28.86 28.86,28.86 U$1.OG2 | 24.95,28.86 U$1.OG1
N$6
  Top 0.229: R6.2 32.42,18.73 29.4,18.73 U1.13
N$7
  Top 0.229: U1.23 25.66,21.04 25.66,23.38 26.62,24.34 26.62,26.08 U$1.D-2 26.37,26.37 27.26,27.26 27.26,27.62 U$1.D-
N$8
  Top 0.229: U1.24 25.13,21.04 25.13,23.38 26.27,24.52 26.27,25.23 25.84,25.66 25.84,26.73 26.37,27.26 26.37,27.62 U$1.D+
  Bottom 0.229: U$1.D+2 27.26,26.37 27.26,26.55 26.55,27.26 26.55,27.62 U$1.D+
N$9
  Top 0.229: U1.31 24.42,17.13 19.97,17.13 18.9,18.19 18.9,20.33 17.48,21.75 SWC.TP
N$10
  Top 0.229: U1.32 24.42,16.59 19.97,16.59 17.3,19.26 SWD.TP
N$11  (via drill 0.3)
  Top 0.229: v18.47,36.23 19.21,35.49 R4.2 | v21.75,39.89 22.71,39.89 23.24,40.42 U2.5 | v30.28,18.19 29.4,18.19 U1.12 | v28.22,35.8 28.22,36.51 U2.1
  Bottom 0.229: v18.47,36.23 18.47,36.6 21.16,39.3 | v21.75,39.89 21.16,39.3 | v30.28,18.19 30.28,25.13 30.82,25.66 30.82,29.65 26.44,34.02 | 21.16,39.3 26.44,34.02 | 26.44,34.02 v28.22,35.8
N$12
  Top 0.229: R2.1 29.82,37.57 28.58,37.57 28.4,37.75 U2.2 27.52,37.17 22.25,37.17 20.57,35.49 R4.1
N$13
  Top 0.229: R10.1 27.08,30.17 27.08,29.4 25.48,27.79 U$1.CC1
N$14
  Top 0.229: R9.2 28.15,30.17 28.15,29.65 27.54,29.04 27.54,28.58 28.15,27.97 28.15,26.37 U$1.CC2
N$15
  Top 0.229: U2.3 28.4,39.17 29.82,39.17 30.18,38.82 C2.2 30.36,38.82 31.78,38.82 R3.2 R5.1
N$16
  Top 0.229: R2.2 30.89,37.4 26.8,33.31 21.93,33.31 21.22,32.6 C1.2
N$17  (via drill 0.3)
  Top 0.229: 19.44,32.6 19.44,31.2 v18.87,31.2 | 19.44,32.6 19.44,33.84 R1.1 | 19.44,32.6 C1.1
  Bottom 0.229: U$2.3 17.9,31.2 v18.87,31.2
N$18
  Top 0.229: U2.7 23.42,37.93 23.42,39.17 U2.6
N$19  (via drill 0.3)
  Top 0.229: v26.73,14.99 26.19,15.53 26.19,15.88 U1.3 | v36.68,27.79 36.15,27.79 35.8,28.15 C4.1
  Bottom 0.229: v26.73,14.99 28.15,14.99 30.82,17.66 31.53,17.66 32.95,19.08 32.95,24.06 v36.68,27.79
N$20
  Top 0.229: R11.2 32.95,28.86 33.31,28.86 33.84,28.33 C4.2
N$21
  Top 0.229: 32.95,29.93 32.95,31 U$3.4 | 32.95,29.93 35.08,29.93 R12.2 | 32.95,29.93 R11.1
N$22
  Top 0.61: C12.- 21.33,43.4 22.7,42.03 32.82,42.03 32.93,41.93 33.9,42.9 C11.-
N$23
  Top 0.229: C10.1 30.82,32.06 32.77,32.06 32.95,32.24 U$3.3 33.13,32.42 33.13,33.48 U$3.2
N$24  (via drill 0.6 pad 1.2)
  Top 0.229: R12.1 36.33,29.93 36.86,29.93 37.51,30.58 37.93,31 U$3.5 | 37.57,41.13 C11.+
  Top 0.61: v35.87,32.22 37.51,30.58 | v35.87,38.44 35.87,39.43 37.57,41.13
  Bottom 0.61: v35.87,38.44 v35.87,32.22
N$25  (via drill 0.3)
  Top 0.229: v31.17,18.19 30.64,17.66 29.4,17.66 U1.11 | v31.71,33.84 32.6,34.73 33.2,34.73 33.18,34.76 U$3.1
  Bottom 0.229: v31.17,18.19 30.67,18.69 30.67,23.74 31.71,24.77 v31.71,33.84
N$26
  Top 0.229: 37.93,34.91 U$3.8
  Top 0.61: 37.93,34.91 35.44,34.91 S-.TP
N$27  (via drill 0.3)
  Top 0.229: U4.G 12.18,17.13 v12.18,18.11 | v17.3,17.84 20.68,14.46 27.08,14.46 28.15,15.53 28.15,15.88 U1.7
  Bottom 0.229: v17.3,17.84 12.5,17.84 12.33,18.02 v12.18,18.11
N$28  (via drill 0.3)
  Top 0.229: U5.G 27.4,9.33 v26.93,9.8 | v28.68,14.64 28.68,15.88 U1.8
  Bottom 0.229: v28.68,14.64 28.68,11.44 27.08,9.84 v26.93,9.8
N$29  (via drill 0.3)
  Top 0.229: U6.G 42,18.11 v41.68,18.11 | v33.48,19.62 29.4,19.62 U1.15 | v38.11,19.61 v36.36,19.61
  Bottom 0.229: v41.68,18.11 39.61,18.11 v38.11,19.61 | v36.36,19.61 v33.49,19.61 v33.48,19.62
N$30  (via drill 0.3)
  Top 0.229: U7.G 44.05,27.4 v44.05,26.93 | v41.66,24.59 41.54,24.47 35.87,24.47 33.86,22.46 31.35,22.46 31.17,22.28 31.17,22 U1.16
  Bottom 0.229: v41.66,24.59 43.97,26.91 v44.05,26.93
N$31  (via drill 0.3)
  Top 0.229: U8.G 41.6,35.82 v41.68,35.74 | v37.75,26.19 36.68,26.19 36.33,25.84 36.33,25.48 33.66,22.82 31.17,22.82 29.4,21.04 28.68,21.04 U1.17
  Bottom 0.229: v37.75,26.19 37.75,31.71 41.66,35.62 v41.68,35.74
N$32  (via drill 0.3)
  Top 0.229: U9.G 26.45,44.53 v26.93,44.05 | v31.17,25.13 28.15,22.11 28.15,21.04 U1.18
  Bottom 0.229: v31.17,25.13 31.17,33.73 24.08,40.83 20.13,40.83 19.48,41.48 19.48,42.45 21.01,43.97 26.91,43.97 v26.93,44.05
N$33  (via drill 0.3)
  Top 0.229: U10.G 11.89,35.74 v12.18,35.74 | v27.62,21.75 27.62,21.04 U1.19
  Bottom 0.229: v27.62,21.75 25.13,24.24 23.71,24.24 12.33,35.62 v12.18,35.74
N$34  (via drill 0.3)
  Top 0.229: U11.G 9.8,26.45 v9.8,26.93 | v26.19,22.28 27.08,21.39 27.08,21.04 U1.20
  Bottom 0.229: v26.19,22.28 26.13,22.35 19.33,22.35 14.77,26.91 9.84,26.91 v9.8,26.93
N$35  (via drill 0.3)
  Top 0.229: v20.15,15.88 25.13,15.88 U1.1
  Bottom 0.229: v20.15,15.88 18.19,15.88 16.77,14.46 LED3.4-DIN
N$36  (via drill 0.35)
  Top 0.229: v19.93,5.43 v18.43,3.93
  Bottom 0.229: LED4.4-DIN 32.16,6.13 31.3,6.99 21.49,6.99 v19.93,5.43 | v18.43,3.93 17.77,3.27 LED3.2-DOUT
N$37  (via drill 0.35)
  Top 0.229: v41.13,15.67 41.13,15.73 v40.12,16.74
  Bottom 0.229: LED5.4-DIN 37.22,39.53 37.22,19.63 v40.12,16.74 | v41.13,15.67 41.87,14.92 LED4.2-DOUT
N$38  (via drill 0.35)
  Top 0.229: v33.93,46.93 v33.93,48.43
  Bottom 0.229: LED6.4-DIN 19.82,47.72 22.78,44.76 30.54,44.76 32.7,46.93 v33.93,46.93 | v33.93,48.43 36.08,50.58 LED5.2-DOUT
N$39
  Top 0.229: 17.3,41.13 16.24,41.13 C12.+
  Top 0.61: 17.3,41.13 20.86,37.57 S+.TP
N$40
  Top 0.61: JP1.2 10.22,12.49 U4.+
N$41
  Top 0.61: JP2.2 U5.+
N$42
  Top 0.61: JP3.2 U6.+
N$43
  Top 0.61: JP4.2 U7.+
N$44
  Top 0.61: JP5.2 U8.+
N$45
  Top 0.61: JP6.2 U9.+
N$46
  Top 0.61: JP7.2 U10.+
N$47
  Top 0.61: JP8.2 U11.+
N$48  (via drill 0.6 pad 1)
  other vias: 16.43,37.43
N$49
  Top 0.254: U12.1 36.07,12.72 36.22,12.47 36.43,12.41 36.7,12.57 U12.14 37.06,12.56 37.18,12.67 38.05,12.67 R13.2
N$50  (via drill 0.35)  (3 unrouted)
  Top 0.61: 39.93,7.93 U$5.P$1 | v39.3,6.05 40.42,6.78 U$5.P$1 | v38.35,7.78 39.93,7.93 | v38.68,7.24 39.93,7.93 | U$5.P$1 v38.97,6.66 39.93,7.93
  Bottom 0.61: U12.11_3 36.74,10.75 39.3,6.07 v39.3,6.05
N$51
  Top 0.254: U12.3 34.37,13.48 C20.1
N$52  (via drill 0.35)  (3 unrouted)
  Top 0.61: 37.36,5.11 U$5.P$2 | v37.55,7.36 36.93,6.93 v37.86,6.8 36.93,5.93 v38.18,6.24 37.36,5.11 | v38.51,5.72 37.36,5.11
  Bottom 0.61: U12.9_3 38.49,5.68 v38.51,5.72
N$54
  Top 0.254: U12.2 35.29,13.12 35.28,13.13 35.28,13.76 R15.2
V+  (via drill 0.35)
  Top 0.229: C9.2 39.89,32.06 38.29,32.06 38.11,32.24 U$3.6 | R15.1 35.52,14.43 35.31,14.64 34.18,14.64 33.08,13.53 33.08,13.23 33.46,12.58 34.07,11.53 34.11,11.47 | 33.77,10.91 33.77,11.23
  Top 0.254: U12.5 34.16,11.52 34.11,11.47 | 34.07,11.53 33.77,11.23 | 33.77,10.91 34.16,10.52 34.73,10.52 U12.7_8
  Top 0.406: U12.7_8 34.43,9.02 C15.1 34.92,7.7 33.61,6.97 C17.1 C16.1 34.31,4.46 34.1,4.25 34.1,2.6 v33.93,2.43 | C9.2 40.05,30.81 40.07,30.8 v40.07,30.77
  Bottom 0.406: v33.93,2.43 33.09,2.43 31.48,0.81 22.36,0.81 20.52,2.65 20.52,3.48 LED3.1-VDD 17.54,6.46 13.86,6.46 11.9,8.42 11.9,9.04 13.63,10.77 13.63,13.83 13.74,14.25 13.63,14.45 13.63,15.67 11.57,17.73 11.57,18.86 12.52,19.81 12.52,25.14 11.34,26.32 9.55,26.32 9.19,26.67 9.19,31.95 11.07,33.82 11.07,35.49 13.63,38.05 LED6.1-VDD 17.2,48.84 19.94,48.84 22.1,46.68 31.52,46.68 32.56,47.72 LED5.1-VDD 37.31,46.39 40.49,46.39 41.45,45.43 41.45,44.81 40.07,43.42 40.07,38.52 42.28,36.31 42.28,35.49 40.07,33.27 v40.07,30.77 40.07,20.58 42.28,18.36 42.28,17.86 40.22,15.8 LED4.1-VDD 40.48,8.32 40.48,6.19 39.88,5.59 38.79,4.99 36.63,4.99 35.5,3.85 34.07,2.43 v33.93,2.43

### Text on the board
tPlace: IDEO | FLOWER